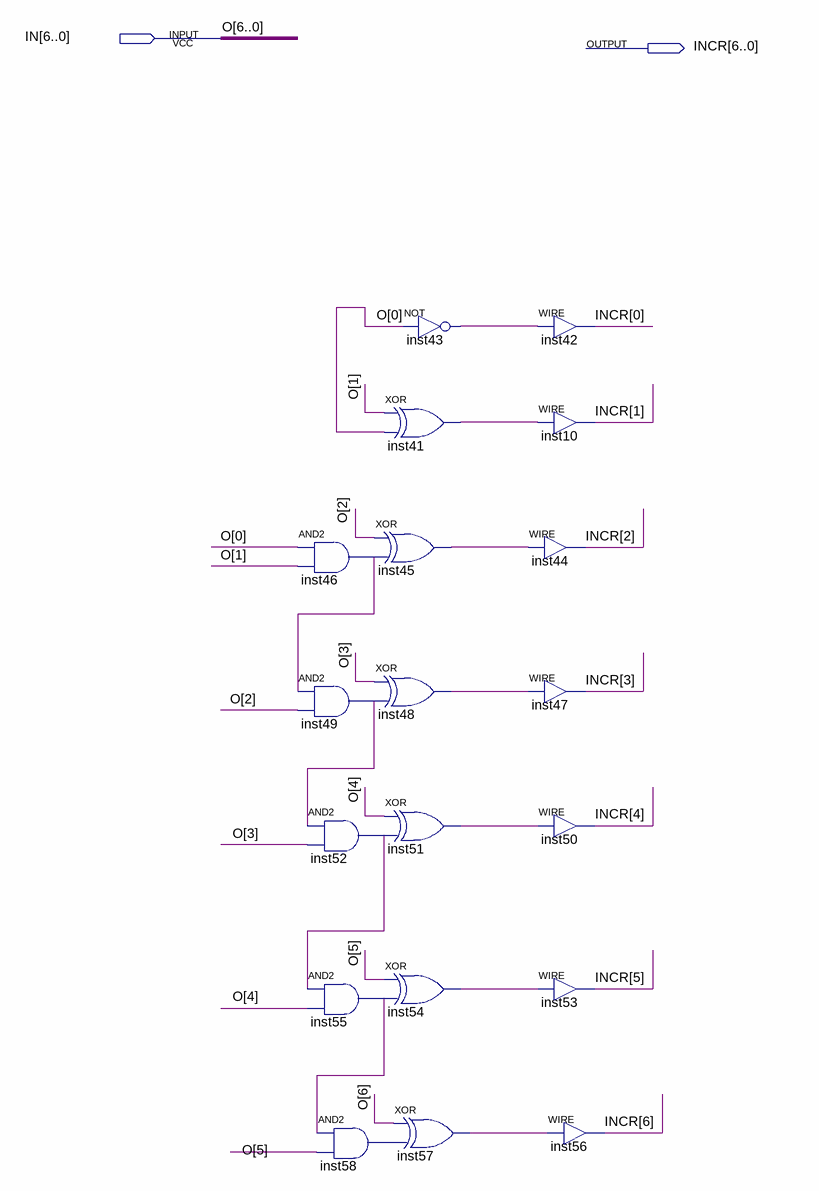
[diagram p0: schematic sheet]
// Quartus schematic INCRIMENTOR.bdf as structural Verilog: 19 symbols, 2 pins
module INCRIMENTOR (
  input  [6:0] IN,
  output [6:0] INCR
);

  wire inst41_out, inst43_out, inst45_out, inst46_out, inst48_out, inst49_out, inst51_out, inst52_out,
       inst54_out, inst55_out, inst57_out, inst58_out;

  and inst46 (inst46_out, IN[0], IN[1]);
  and inst49 (inst49_out, inst46_out, IN[2]);
  and inst52 (inst52_out, inst49_out, IN[3]);
  and inst55 (inst55_out, inst52_out, IN[4]);
  and inst58 (inst58_out, inst55_out, IN[5]);
  not inst43 (inst43_out, IN[0]);
  xor inst41 (inst41_out, IN[1], IN[0]);
  xor inst45 (inst45_out, IN[2], inst46_out);
  xor inst48 (inst48_out, IN[3], inst49_out);
  xor inst51 (inst51_out, IN[4], inst52_out);
  xor inst54 (inst54_out, IN[5], inst55_out);
  xor inst57 (inst57_out, IN[6], inst58_out);
  assign INCR[0] = inst43_out;  // WIRE inst42
  assign INCR[1] = inst41_out;  // WIRE inst10
  assign INCR[2] = inst45_out;  // WIRE inst44
  assign INCR[3] = inst48_out;  // WIRE inst47
  assign INCR[4] = inst51_out;  // WIRE inst50
  assign INCR[5] = inst54_out;  // WIRE inst53
  assign INCR[6] = inst57_out;  // WIRE inst56

  // Other names for the same wires on the sheet: O[6:0] = IN
endmodule
